# Altium schematic sheet ДФТВ.434519.003 л.1 Э3.SchDoc
size 420 x 297 mm; SheetNumber: 1; SheetTotal: 2; ListNumber: 1
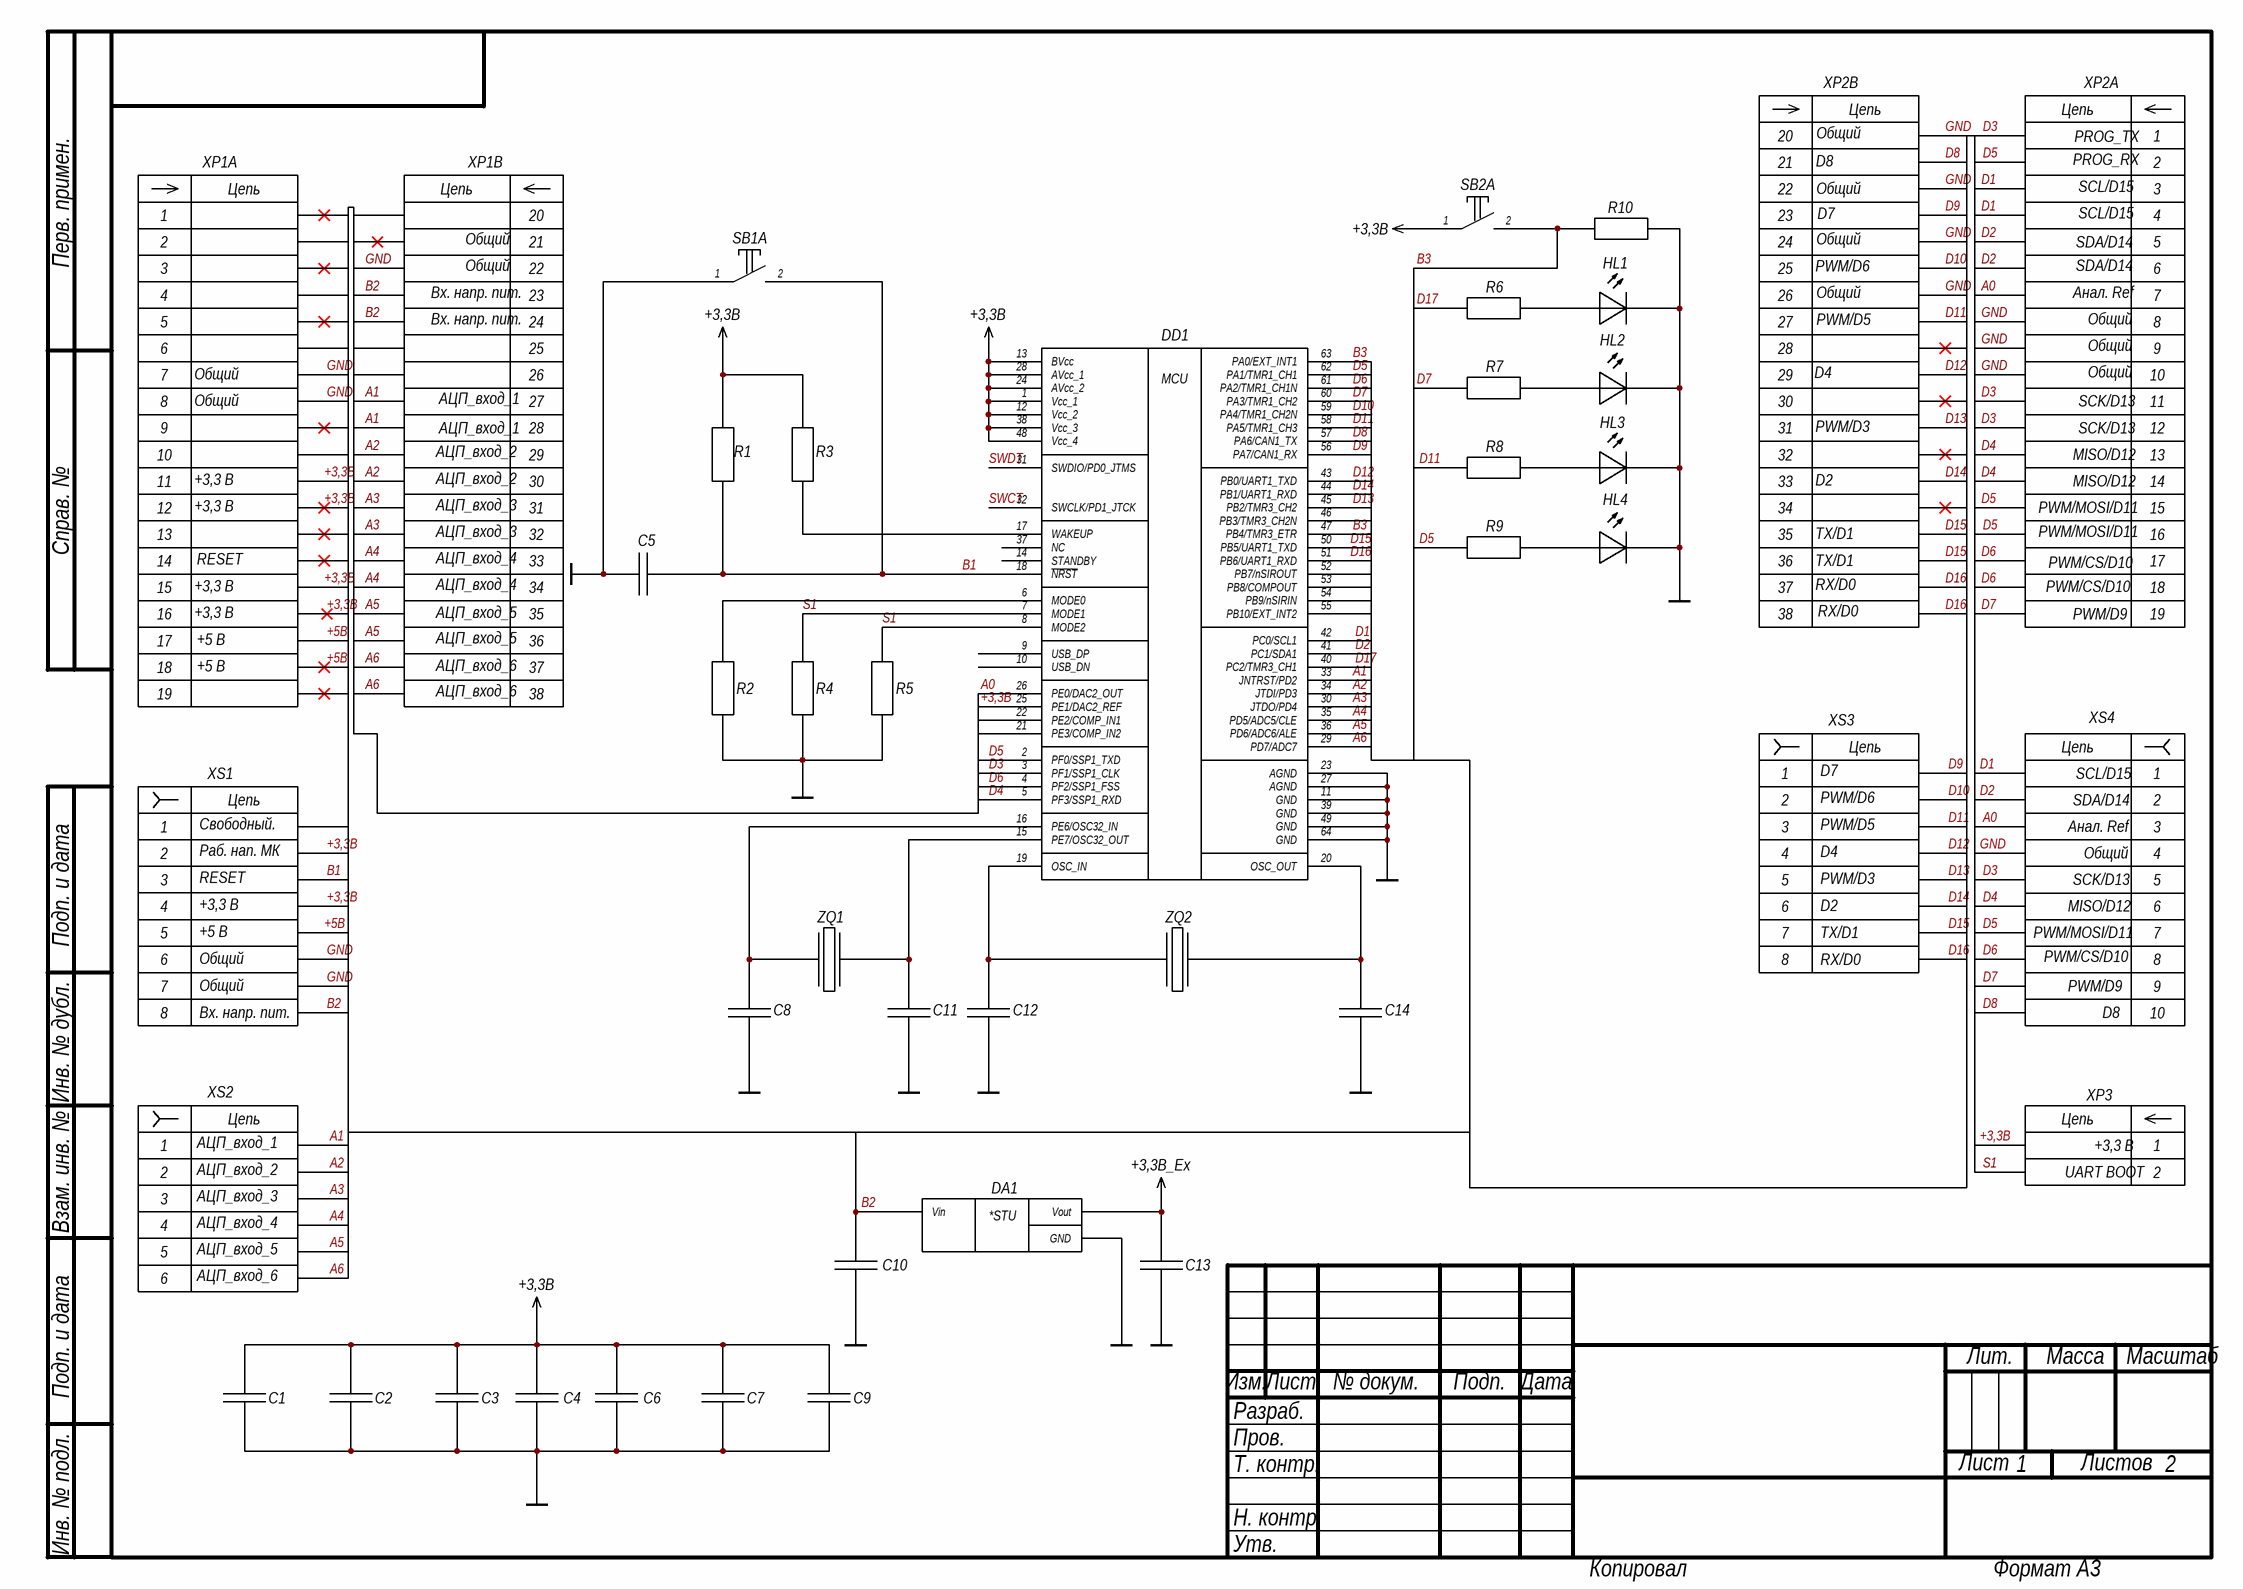
[diagram p0: ДФТВ.434519.003 л.1 Э3.SchDoc]

## Parts
C1  Конденсатор  [SMD_C0603]  (value not drawn)
C2  Конденсатор  [SMD_C0603]  (value not drawn)
C3  Конденсатор  [SMD_C0603]  (value not drawn)
C4  Конденсатор  [SMD_C0603]  (value not drawn)
C5  Конденсатор  [SMD_C0603]  (value not drawn)
C6  Конденсатор  [SMD_C0603]  (value not drawn)
C7  Конденсатор  [SMD_C0603]  (value not drawn)
C8  Конденсатор  [SMD_C0603]  (value not drawn)
C9  Конденсатор  [SMD_C0603]  (value not drawn)
C10  Конденсатор  [SMD_C0603]  (value not drawn)
C11  Конденсатор  [SMD_C0603]  (value not drawn)
C12  Конденсатор  [SMD_C0603]  (value not drawn)
C13  Конденсатор  [SMD_C0603]  (value not drawn)
C14  Конденсатор  [SMD_C0603]  (value not drawn)
DA1  Преобразователи напряжения  [SOT223]  (value not drawn)
DD1  Микроконтроллеры  [MDR-QFN64_N]  (value not drawn)
HL1  Светодиод  [DIODE: LED-0603-AMBER]  (value not drawn)
HL2  Светодиод  [DIODE: LED-0603-BLUE]  (value not drawn)
HL3  Светодиод  [DIODE: LED-0603-WHITE]  (value not drawn)
HL4  Светодиод  [DIODE: LED-0603-YELLOW]  (value not drawn)
R1  Резистор  [R0603]  (value not drawn)
R2  Резистор  [R0603]  (value not drawn)
R3  Резистор  [R0603]  (value not drawn)
R4  Резистор  [R0603]  (value not drawn)
R5  Резистор  [R0603]  (value not drawn)
R6  Резистор  [R0603]  (value not drawn)
R7  Резистор  [R0603]  (value not drawn)
R8  Резистор  [R0603]  (value not drawn)
R9  Резистор  [R0603]  (value not drawn)
R10  Резистор  [R0603]  (value not drawn)
SB1  Переключатель  [BUT: 6x6 SMD]  (value not drawn)  (part A of 2)
SB2  Переключатель  [BUT: 6x6 SMD]  (value not drawn)  (part A of 2)
XP1  Вилка  [PLDH-38]  (value not drawn)  (parts A,B of 2)
XP2  Вилка  [PLDH-38]  (value not drawn)  (parts A,B of 2)
XP3  Вилка  [PLS-2]  (value not drawn)
XS1  Розетка  [PBS-8]  (value not drawn)
XS2  Розетка  [PBS-6]  (value not drawn)
XS3  Розетка  [PBS-8]  (value not drawn)
XS4  Розетка  [PBS-10]  (value not drawn)
ZQ1  Кварцевые резонаторы  [DSO-N4]  (value not drawn)
ZQ2  Кварцевые резонаторы  [HC-49S]  (value not drawn)

## Nets
+3,3В: C1.2 C2.2 C3.2 C4.2 C6.2 C7.2 C9.2 DD1.1(Vcc_1) DD1.12(Vcc_2) DD1.13(BVcc) DD1.24(AVcc_2) DD1.25(PE1/DAC2_REF) DD1.28(AVcc_1) DD1.38(Vcc_3) DD1.48(Vcc_4) R1.2 R3.2 SB2.1 XP1.11 XP1.12 XP1.15 XP1.16 XP3.1 XS1.2 XS1.4
+3,3В_Ex: C13.2 DA1.2(Vout)
GND: C1.1 C2.1 C3.1 C4.1 C5.2 C6.1 C7.1 C8.1 C9.1 C10.1 C11.1 C12.1 C13.1 C14.1 DA1.1(GND) DD1.11(GND) DD1.23(AGND) DD1.27(AGND) DD1.39(GND) DD1.49(GND) DD1.64(GND) HL1.K HL2.K HL3.K HL4.K R2.1 R4.1 R5.1 R10.1 SB1.1 XP1.7 XP1.8 XP1.22 XP2.8 XP2.9 XP2.10 XP2.20 XP2.22 XP2.24 XP2.26 XS1.6 XS1.7 XS4.4
+5В: XP1.17 XP1.18 XS1.5
A0: DD1.26(PE0/DAC2_OUT) XP2.7 XS4.3
A1: DD1.33(JNTRST/PD2) XP1.27 XP1.28 XS2.1
A2: DD1.34(JTDI/PD3) XP1.29 XP1.30 XS2.2
A3: DD1.30(JTDO/PD4) XP1.31 XP1.32 XS2.3
A4: DD1.35(PD5/ADC5/CLE) XP1.33 XP1.34 XS2.4
A5: DD1.36(PD6/ADC6/ALE) XP1.35 XP1.36 XS2.5
A6: DD1.29(PD7/ADC7) XP1.37 XP1.38 XS2.6
B1: C5.1 DD1.18(~{NRST}) R1.1 SB1.2 XS1.3
B2: C10.2 DA1.3(Vin) XP1.23 XP1.24 XS1.8
B3: DD1.47(PB4/TMR3_ETR) DD1.63(PA0/EXT_INT1) R10.2 SB2.2
D1: DD1.42(PC0/SCL1) XP2.3 XP2.4 XS4.1
D2: DD1.41(PC1/SDA1) XP2.5 XP2.6 XS4.2
D3: DD1.3(PF1/SSP1_CLK) XP2.1 XP2.11 XP2.12 XS4.5
D4: DD1.5(PF3/SSP1_RXD) XP2.13 XP2.14 XS4.6
D5: DD1.2(PF0/SSP1_TXD) DD1.62(PA1/TMR1_CH1) R9.2 XP2.2 XP2.15 XP2.16 XS4.7
D6: DD1.4(PF2/SSP1_FSS) DD1.61(PA2/TMR1_CH1N) XP2.17 XP2.18 XS4.8
D7: DD1.60(PA3/TMR1_CH2) R7.2 XP2.19 XS4.9
D8: DD1.57(PA6/CAN1_TX) XP2.21 XS4.10
D9: DD1.56(PA7/CAN1_RX) XP2.23 XS3.1
D10: DD1.59(PA4/TMR1_CH2N) XP2.25 XS3.2
D11: DD1.58(PA5/TMR1_CH3) R8.2 XP2.27 XS3.3
D12: DD1.43(PB0/UART1_TXD) XP2.29 XS3.4
D13: DD1.45(PB2/TMR3_CH2) XP2.31 XS3.5
D14: DD1.44(PB1/UART1_RXD) XP2.33 XS3.6
D15: DD1.50(PB5/UART1_TXD) XP2.35 XP2.36 XS3.7
D16: DD1.51(PB6/UART1_RXD) XP2.37 XP2.38 XS3.8
D17: DD1.40(PC2/TMR3_CH1) R6.2
S1: DD1.7(MODE1) DD1.8(MODE2) R4.2 R5.2 XP3.2
SWCT: DD1.32(SWCLK/PD1_JTCK)
SWDT: DD1.31(SWDIO/PD0_JTMS)
NetC8_2: C8.2 DD1.16(PE6/OSC32_IN) ZQ1.1
NetC11_2: C11.2 DD1.15(PE7/OSC32_OUT) ZQ1.3
NetC12_2: C12.2 DD1.19(OSC_IN) ZQ2.1
NetC14_2: C14.2 DD1.20(OSC_OUT) ZQ2.3
NetDD1_6: DD1.6(MODE0) R2.2
NetDD1_17: DD1.17(WAKEUP) R3.1
NetHL1_A: HL1.A R6.1
NetHL2_A: HL2.A R7.1
NetHL3_A: HL3.A R8.1
NetHL4_A: HL4.A R9.1

Not connected (* = marked no-connect by the designer): DD1 9(USB_DP) 10(USB_DN) 14(STANDBY) 21(PE3/COMP_IN2) 22(PE2/COMP_IN1) 37(NC) 46(PB3/TMR3_CH2N) 52(PB7/nSIROUT) 53(PB8/COMPOUT) 54(PB9/nSIRIN) 55(PB10/EXT_INT2); XP1 1* 2 3* 4 5* 6 9* 10 13* 14* 19* 20 21* 25 26; XP2 28* 30* 32* 34*; XS1 1

## Notes on the sheet
- D8
- Общий
- (near XP2) PROG_RX
- (near XP2) PROG_TX
- (near XP2) SCL/D15
- D7
- (near XP2) SDA/D14
- (near XP1) Вх. напр. пит.
- (near XP2) PWM/D6
- (near XP2) PWM/D5
- (near XP2) Анал. Ref
- D4
- (near XP1) АЦП_вход_2
- (near XP1) АЦП_вход_1
- (near XP2) PWM/D3
- (near XP2) MISO/D12
- (near XP2) SCK/D13
- (near XP1) +3,3 В
- (near XP1) АЦП_вход_3
- D2
- (near XP2) PWM/MOSI/D11
- RESET
- (near XP1) АЦП_вход_4
- TX/D1
- RX/D0
- (near XP2) PWM/CS/D10
- +5 В
- (near XP1) АЦП_вход_5
- (near XP2) PWM/D9
- (near XP1) АЦП_вход_6
- (near XS4) SCL/D15
- (near XS1) Свободный.
- (near XS1) Раб. нап. МК
- (near XS3) PWM/D5
- (near XS3) PWM/D6
- (near XS4) Анал. Ref
- (near XS4) SDA/D14
- (near XS1) +3,3 В
- (near XS3) PWM/D3
- (near XS4) MISO/D12
- (near XS4) SCK/D13
- (near XS4) PWM/MOSI/D11
- (near XS4) PWM/CS/D10
- (near XS4) PWM/D9
- (near XS1) Вх. напр. пит.
- (near XS2) АЦП_вход_1
- (near XS2) АЦП_вход_2
- (near XS2) АЦП_вход_3
- (near XP3) UART BOOT
- +3,3 В
- (near XS2) АЦП_вход_4
- (near XS2) АЦП_вход_5
- (near XS2) АЦП_вход_6
- Перв. примен.
- Справ. №
- Подп. и дата
- Инв. № дубл.
- Взам. инв. №
- Разраб.
- Изм.
- Лист
- № докум.
- Подп.
- Дата
- Лит.
- Масса
- Масштаб
- Пров.
- Т. контр.
- Листов
- Инв. № подл.
- Н. контр.
- Утв.
- Копировал
- Формат А3
- (in symbol AMS1117-3.3) *STU
- (in symbol Вилка 2 контакт) Цепь
- (in symbol Вилка 38 контактов, part A) Цепь
- (in symbol Вилка 38 контактов, part B) Цепь
- (in symbol Микроконтроллер К1986ВЕ92QI) MCU
- (in symbol Розетка 6 контактов) Цепь
- (in symbol Розетка 8 контактов) Цепь
- (in symbol Розетка 10 контактов) Цепь

## Library data of the parts
C1-C7 C9 C10 C13 = Конденсаторы керамические: АДПК.673511.021 ТУ; Model: CL21B104JBCNNNC; Product Code: 34 1469; Component Name: К10-79-10В-0,1 мкФ+80/-20%-Н90; Value: 0.1 мкФ; Published: 18.05.2019; Publisher: АО НПО "КАДЕТЕК"; Distributer: АО НИИ "Гириконд"; TU/GOST: АДПК.673511.021 ТУ; Category: Конденсатор
C8 C11 C12 C14 = Конденсаторы керамические: АДПК.673511.021 ТУ; Model: CL21B104JBCNNNC; Product Code: 34 1469; Component Name: К10-79-100В-24 пФ±5%-МП0; Value: 24 пФ; Published: 18.05.2019; Publisher: АО НПО "КАДЕТЕК"; Distributer: АО НИИ "Гириконд"; TU/GOST: АДПК.673511.021 ТУ; Category: Конденсатор
DA1 = AMS1117-3.3: фирма Advanced Monolithic System; TU/GOST: ДВУК.431433.326-001ТУ; Product Code: 63 3300; Component Name: GM1117S-3.3ST3RG; Distributer: АО «Микрон»; Category: Преобразователи напряжения; Model: AMS1117-3.3
DD1 = Микроконтроллер К1986ВЕ92QI: ТСКЯ.431000.001 ТУ; Model: К1986ВЕ92FI; Product Code: 63 3900; Distributer: АО "ПКК Миландр"; Category: Микроконтроллеры; TU/GOST: ТСКЯ.431000.001 ТУ; Component Name: К1986ВЕ92FI
HL1 = Светодиоды: фирма Kingbright Elec. Co., Ltd; TU/GOST: АЕЯР.432220.765 ТУ; Value: 2.1 V; Model: BL-L2506URC; Product Code: 63 1000; Component Name: ИПД169А91-Ж; Published: 24-Mar-1999; LatestRevisionDate: 17-Jul-2002; LatestRevisionNote: Re-released for DXP Platform.; PackageReference: PIN2; Publisher: Altium Limited; Distributer: АО "ПРОТОН"; Category: Светодиод
HL2 = Светодиоды: фирма Kingbright Elec. Co., Ltd; TU/GOST: АЕЯР.432220.765 ТУ; Value: 2.1 V; Model: BL-L2506URC; Product Code: 63 1000; Component Name: ИПД169А91-С; Published: 24-Mar-1999; LatestRevisionDate: 17-Jul-2002; LatestRevisionNote: Re-released for DXP Platform.; PackageReference: PIN2; Publisher: Altium Limited; Distributer: АО "ПРОТОН"; Category: Светодиод
HL3 = Светодиоды: фирма Ningbo Foryard; TU/GOST: АЕЯР.432220.765 ТУ; Value: 2.1 V; Model: BL-L2506URC; Product Code: 63 1000; Component Name: ИПД169А91-Б; Published: 24-Mar-1999; LatestRevisionDate: 17-Jul-2002; LatestRevisionNote: Re-released for DXP Platform.; PackageReference: PIN2; Publisher: Altium Limited; Distributer: АО "ПРОТОН"; Category: Светодиод
HL4 = Светодиоды: фирма Kingbright Elec. Co., Ltd; TU/GOST: АЕЯР.432220.765 ТУ; Value: 2.1 V; Model: BL-L2506URC; Product Code: 63 1000; Component Name: ИПД169А91-K; Published: 24-Mar-1999; LatestRevisionDate: 17-Jul-2002; LatestRevisionNote: Re-released for DXP Platform.; PackageReference: PIN2; Publisher: Altium Limited; Distributer: АО "ПРОТОН"; Category: Светодиод
R1-R5 R10 = Резисторы без указания рассеиваемой мощности: АЛЯР. 434110.005 ТУ; TU/GOST: АБШК.434110.023 ТУ; Product Code: 61 9900; Component Name: Р1-12-0,1-10 кОм±5%-М-"К"; Value: 10 кОм; Published: 8-Jun-2000; LatestRevisionDate: 17-Jul-2002; LatestRevisionNote: Re-released for DXP Platform.; PackageReference: AXIAL-0.4; Publisher: SPA CADETECH JSC; PackageDescription: Axial Device, Thru-Hole; 2 Leads; 0.4 in Pin Spacing; Model: R0603; Category: Резистор; Distributer: АО "НПО ЭРКОН"
R6-R9 = Резисторы без указания рассеиваемой мощности: АЛЯР. 434110.005 ТУ; TU/GOST: АБШК.434110.023 ТУ; Product Code: 61 9900; Component Name: Р1-12-0,1-330 Ом±5%-М-"К"; Value: 330 Ом; Published: 8-Jun-2000; LatestRevisionDate: 17-Jul-2002; LatestRevisionNote: Re-released for DXP Platform.; PackageReference: AXIAL-0.4; Publisher: SPA CADETECH JSC; PackageDescription: Axial Device, Thru-Hole; 2 Leads; 0.4 in Pin Spacing; Model: R0603; Category: Резистор; Distributer: АО "НПО ЭРКОН"
SB1 SB2 = BT-02x-01p_S: фирма KLS electronic co ltd; Product Code: 34 6422; Component Name: KLS7-TS6604-7.0-180-B(Т); Published: 17.04.2014; Publisher: Andrew Danich; Type: Переключатель; TU/GOST: фирма KLS electronic co ltd; Distributer: АО "Чип и Дип"
XP1 XP2 = Вилка 38 контактов: РЮМК.430420.019 ТУ; TU/GOST: РЮМК.430420.041 ТУ; Product Code: 66 7250; Component Name: СНП377-38ВП21-2-14-6,0; Distributer: АО "КАРАЧЕВСКИЙ ЗАВОД "ЭЛЕКТРОДЕТАЛЬ"; Category: Вилка
XP3 = Вилка 2 контакт: Connfly electronic (Zhenqin); TU/GOST: РЮМК.430420.051 ТУ; Product Code: 34 6430; Component Name: СНП393-2ВП21-1-01-6,5; Distributer: АО "КАРАЧЕВСКИЙ ЗАВОД "ЭЛЕКТРОДЕТАЛЬ"; Category: Вилка
XS1 XS3 = Розетка 8 контактов: РЮМК.430420.019 ТУ; TU/GOST: РЮМК.430420.051 ТУ; Product Code: 66 7250; Model: PBD-8; Component Name: СНП393-8РП21-1; Type: Розетка; Distributer: АО "КАРАЧЕВСКИЙ ЗАВОД "ЭЛЕКТРОДЕТАЛЬ"; Category: Розетка
XS2 = Розетка 6 контактов: РЮМК.430420.019 ТУ; Product Code: 66 7250; Component Name: СНП393-6РП21-1; Type: Розетка; TU/GOST: РЮМК.430420.019 ТУ; Distributer: АО "КАРАЧЕВСКИЙ ЗАВОД "ЭЛЕКТРОДЕТАЛЬ"; Category: Розетка; Model: PBS-6
XS4 = Розетка 10 контактов: РЮМК.430420.019 ТУ; TU/GOST: РЮМК.430420.051 ТУ; Product Code: 66 7250; Component Name: СНП393-10РП21-1; Type: Розетка; Distributer: АО "КАРАЧЕВСКИЙ ЗАВОД "ЭЛЕКТРОДЕТАЛЬ"; Category: Розетка; Model: PBS-10
ZQ1 = Кварцевые резонаторы: КЖДГ.433513.017 ТУ; Alternating Manufacture: АО "Завод "Метеор"; Product Code: 63 2100; Model: SMD07050C4; TU/GOST: фирма EPSON; Value: 32768 Hz; Component Name: MC-206 32,768 кГц; Published: 24.05.2021; Publisher: АО "НПО КАДЕТЕК"; Distributer: АО "Чип и Дип"; Category: Кварцевые резонаторы; Type: SMD07050C4
ZQ2 = Кварцевые резонаторы: КЖДГ.433513.026ТУ; Alternating Manufacture: Chequers Electronic Limited; Product Code: 63 2100; Model: HC49S; Value: 12 MHz; Component Name: РК597-МД3-5АС-16000К-П24; Published: 24.05.2021; Publisher: АО "НПО КАДЕТЕК"; Distributer: АО «Завод «Метеор»; TU/GOST: КЖДГ.433513.026ТУ; Category: Кварцевые резонаторы; Type: SMD07050C4